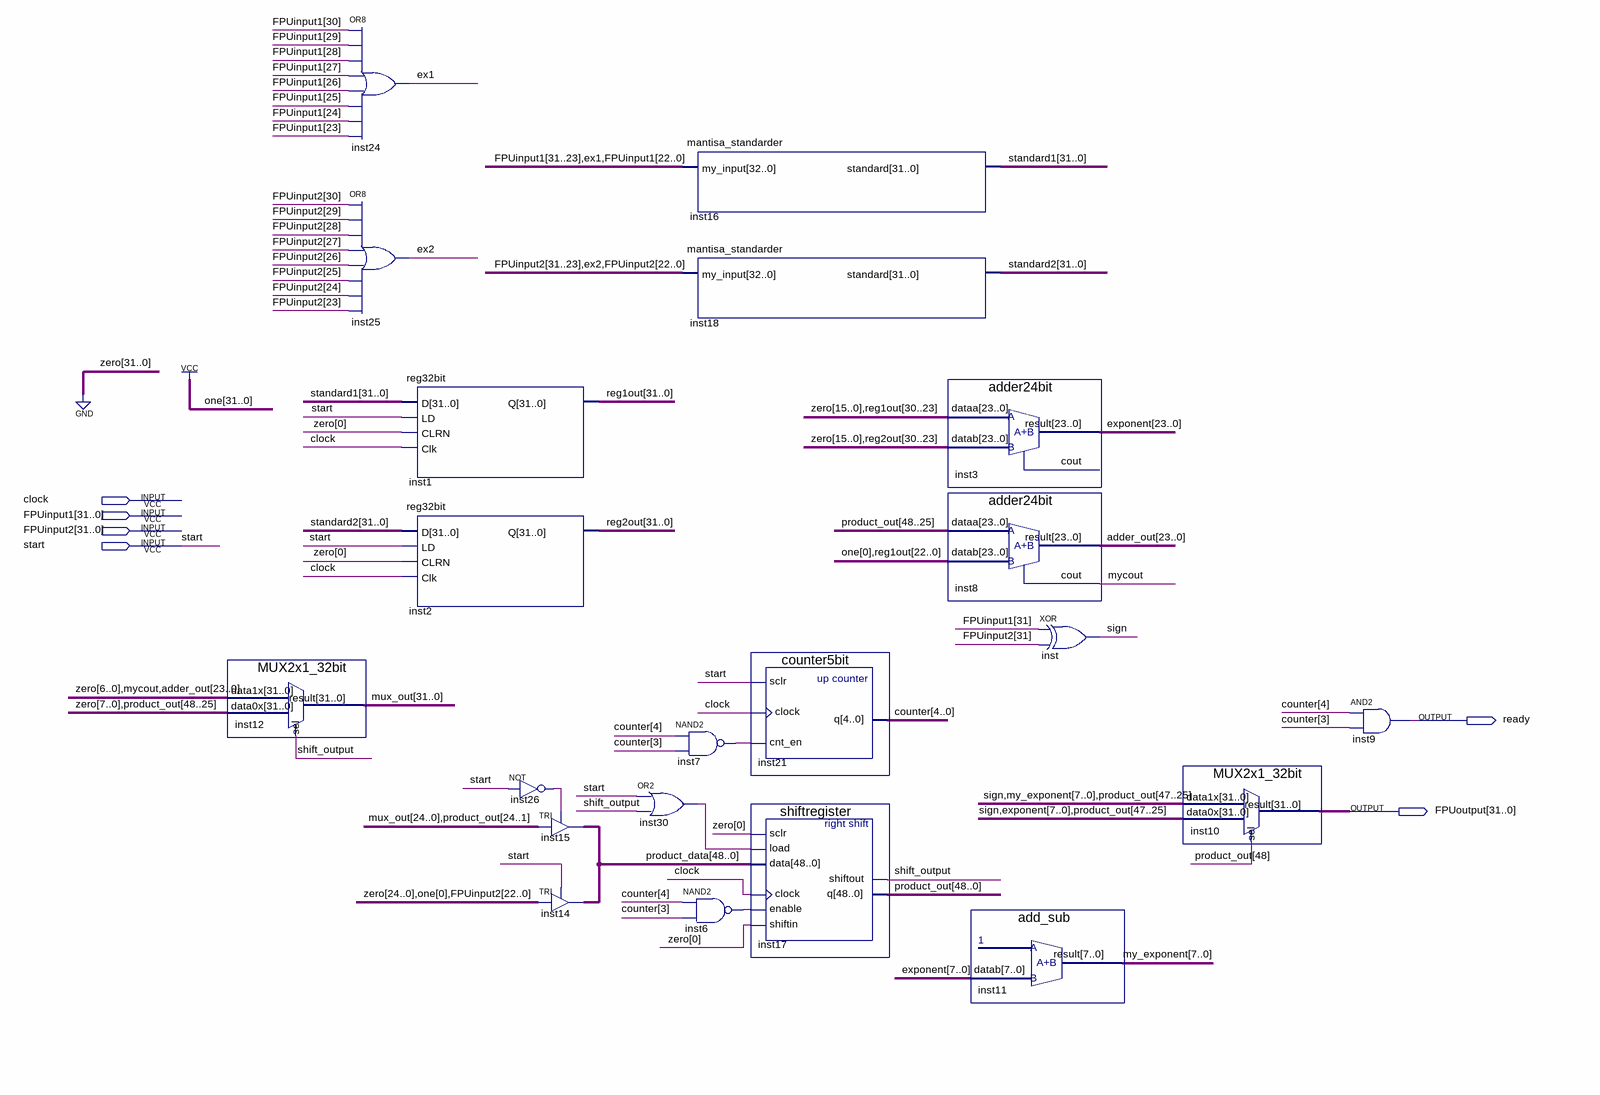
[diagram p0: schematic sheet]
// Quartus schematic FPU.bdf as structural Verilog: 21 symbols, 6 pins
module FPU (
  input  clock,
  input  [31:0] FPUinput1,
  input  [31:0] FPUinput2,
  input  start,
  output ready,
  output [31:0] FPUoutput
);

  wire ex1, ex2, inst6_out, inst7_out, inst26_out, inst30_out, mycout, shift_output, sign;
  wire [4:0] counter;
  wire [7:0] my_exponent;
  wire [23:0] adder_out, exponent;
  wire [31:0] mux_out, reg1out, reg2out, standard1, standard2;
  wire [48:0] product_data, product_out;

  MUX2x1_32bit inst12 (
    .data1x({{7{1'b0}}, mycout, adder_out}), .data0x({{8{1'b0}}, product_out[48:25]}), .sel(shift_output),
    .result(mux_out));
  or inst24 (ex1, FPUinput1[30], FPUinput1[29], FPUinput1[28], FPUinput1[27], FPUinput1[26], FPUinput1[25], FPUinput1[24], FPUinput1[23]);
  or inst25 (ex2, FPUinput2[30], FPUinput2[29], FPUinput2[28], FPUinput2[27], FPUinput2[26], FPUinput2[25], FPUinput2[24], FPUinput2[23]);
  reg32bit inst1 (.D(standard1), .LD(start), .CLRN(1'b0), .Clk(clock), .Q(reg1out));
  reg32bit inst2 (.D(standard2), .LD(start), .CLRN(1'b0), .Clk(clock), .Q(reg2out));
  not inst26 (inst26_out, start);
  TRI inst15[48:0] (.IN({mux_out[24:0], product_out[24:1]}), .OE(inst26_out), .OUT(product_data));
  TRI inst14[48:0] (.IN({26'b00000000000000000000000001, FPUinput2[22:0]}), .OE(start), .OUT(product_data));
  or inst30 (inst30_out, start, shift_output);
  mantisa_standarder inst16 (.my_input({FPUinput1[31:23], ex1, FPUinput1[22:0]}), .standard(standard1));
  mantisa_standarder inst18 (.my_input({FPUinput2[31:23], ex2, FPUinput2[22:0]}), .standard(standard2));
  nand inst7 (inst7_out, counter[4], counter[3]);
  nand inst6 (inst6_out, counter[4], counter[3]);
  counter5bit inst21 (.sclr(start), .clock(clock), .cnt_en(inst7_out), .q(counter));
  shiftregister inst17 (
    .sclr(1'b0), .load(inst30_out), .data(product_data), .clock(clock), .enable(inst6_out), .shiftin(1'b0),
    .shiftout(shift_output), .q(product_out));
  adder24bit inst3 (
    .dataa({{16{1'b0}}, reg1out[30:23]}), .datab({{16{1'b0}}, reg2out[30:23]}), .result(exponent));  // open: cout
  adder24bit inst8 (.dataa(product_out[48:25]), .datab({1'b1, reg1out[22:0]}), .result(adder_out), .cout(mycout));
  add_sub inst11 (.datab(exponent[7:0]), .result(my_exponent));
  xor inst (sign, FPUinput1[31], FPUinput2[31]);
  MUX2x1_32bit inst10 (
    .data1x({sign, my_exponent, product_out[47:25]}), .data0x({sign, exponent[7:0], product_out[47:25]}),
    .sel(product_out[48]), .result(FPUoutput));
  and inst9 (ready, counter[4], counter[3]);
endmodule
